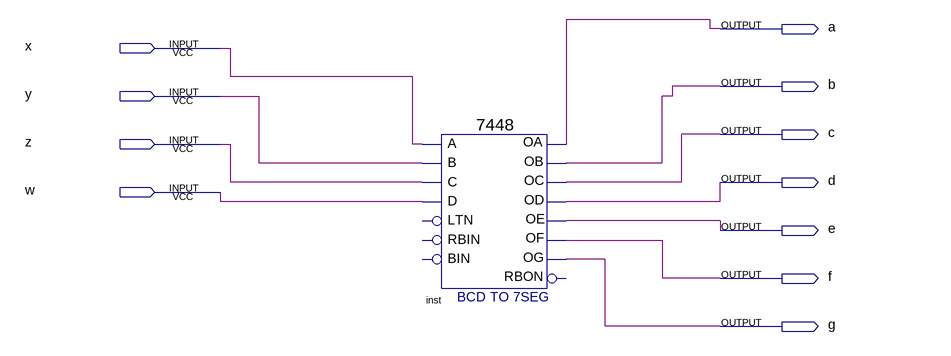
[diagram p0: schematic sheet]
// Quartus schematic Decod.bdf as structural Verilog: 1 symbols, 11 pins
module Decod (
  input  x,
  input  y,
  input  z,
  input  w,
  output a,
  output b,
  output c,
  output d,
  output e,
  output f,
  output g
);

  \7448  inst (
    .A(x), .C(z), .D(w), .B(y), .OC(c), .OE(e), .OD(d), .OF(f), .OG(g), .OB(b), .OA(a));  // open: RBIN, BIN, LTN, RBON
endmodule
